# Altium schematic sheet ATmega328PB_Xplained_Mini_TopLevel.SchDoc: ATmega328PB Xplained Mini
size A3; Organization: ATMEL Norway; Address1: Vestre Rosten 79; Address2: N-7075 TILLER; Address3: NORWAY; DocumentNumber: A09-2523; Revision: 4; SheetNumber: 1; SheetTotal: 3; PageSetup: Record=PageOptions|CenterHorizontal=True|CenterVertical=True|PrintScale=1.01|XCorrection=1.00|YCorrection=1.00|PrintKind=1|BorderSize=5000000|LeftOffset=0|BottomOffset=0|Orientation=2|PaperLength=1000|PaperWidth=1000|Scale=100|PaperSource=7|PrintQuality=-4|MediaType=1|DitherType=10|PaperKind=Letter|PrintScaleMode=1
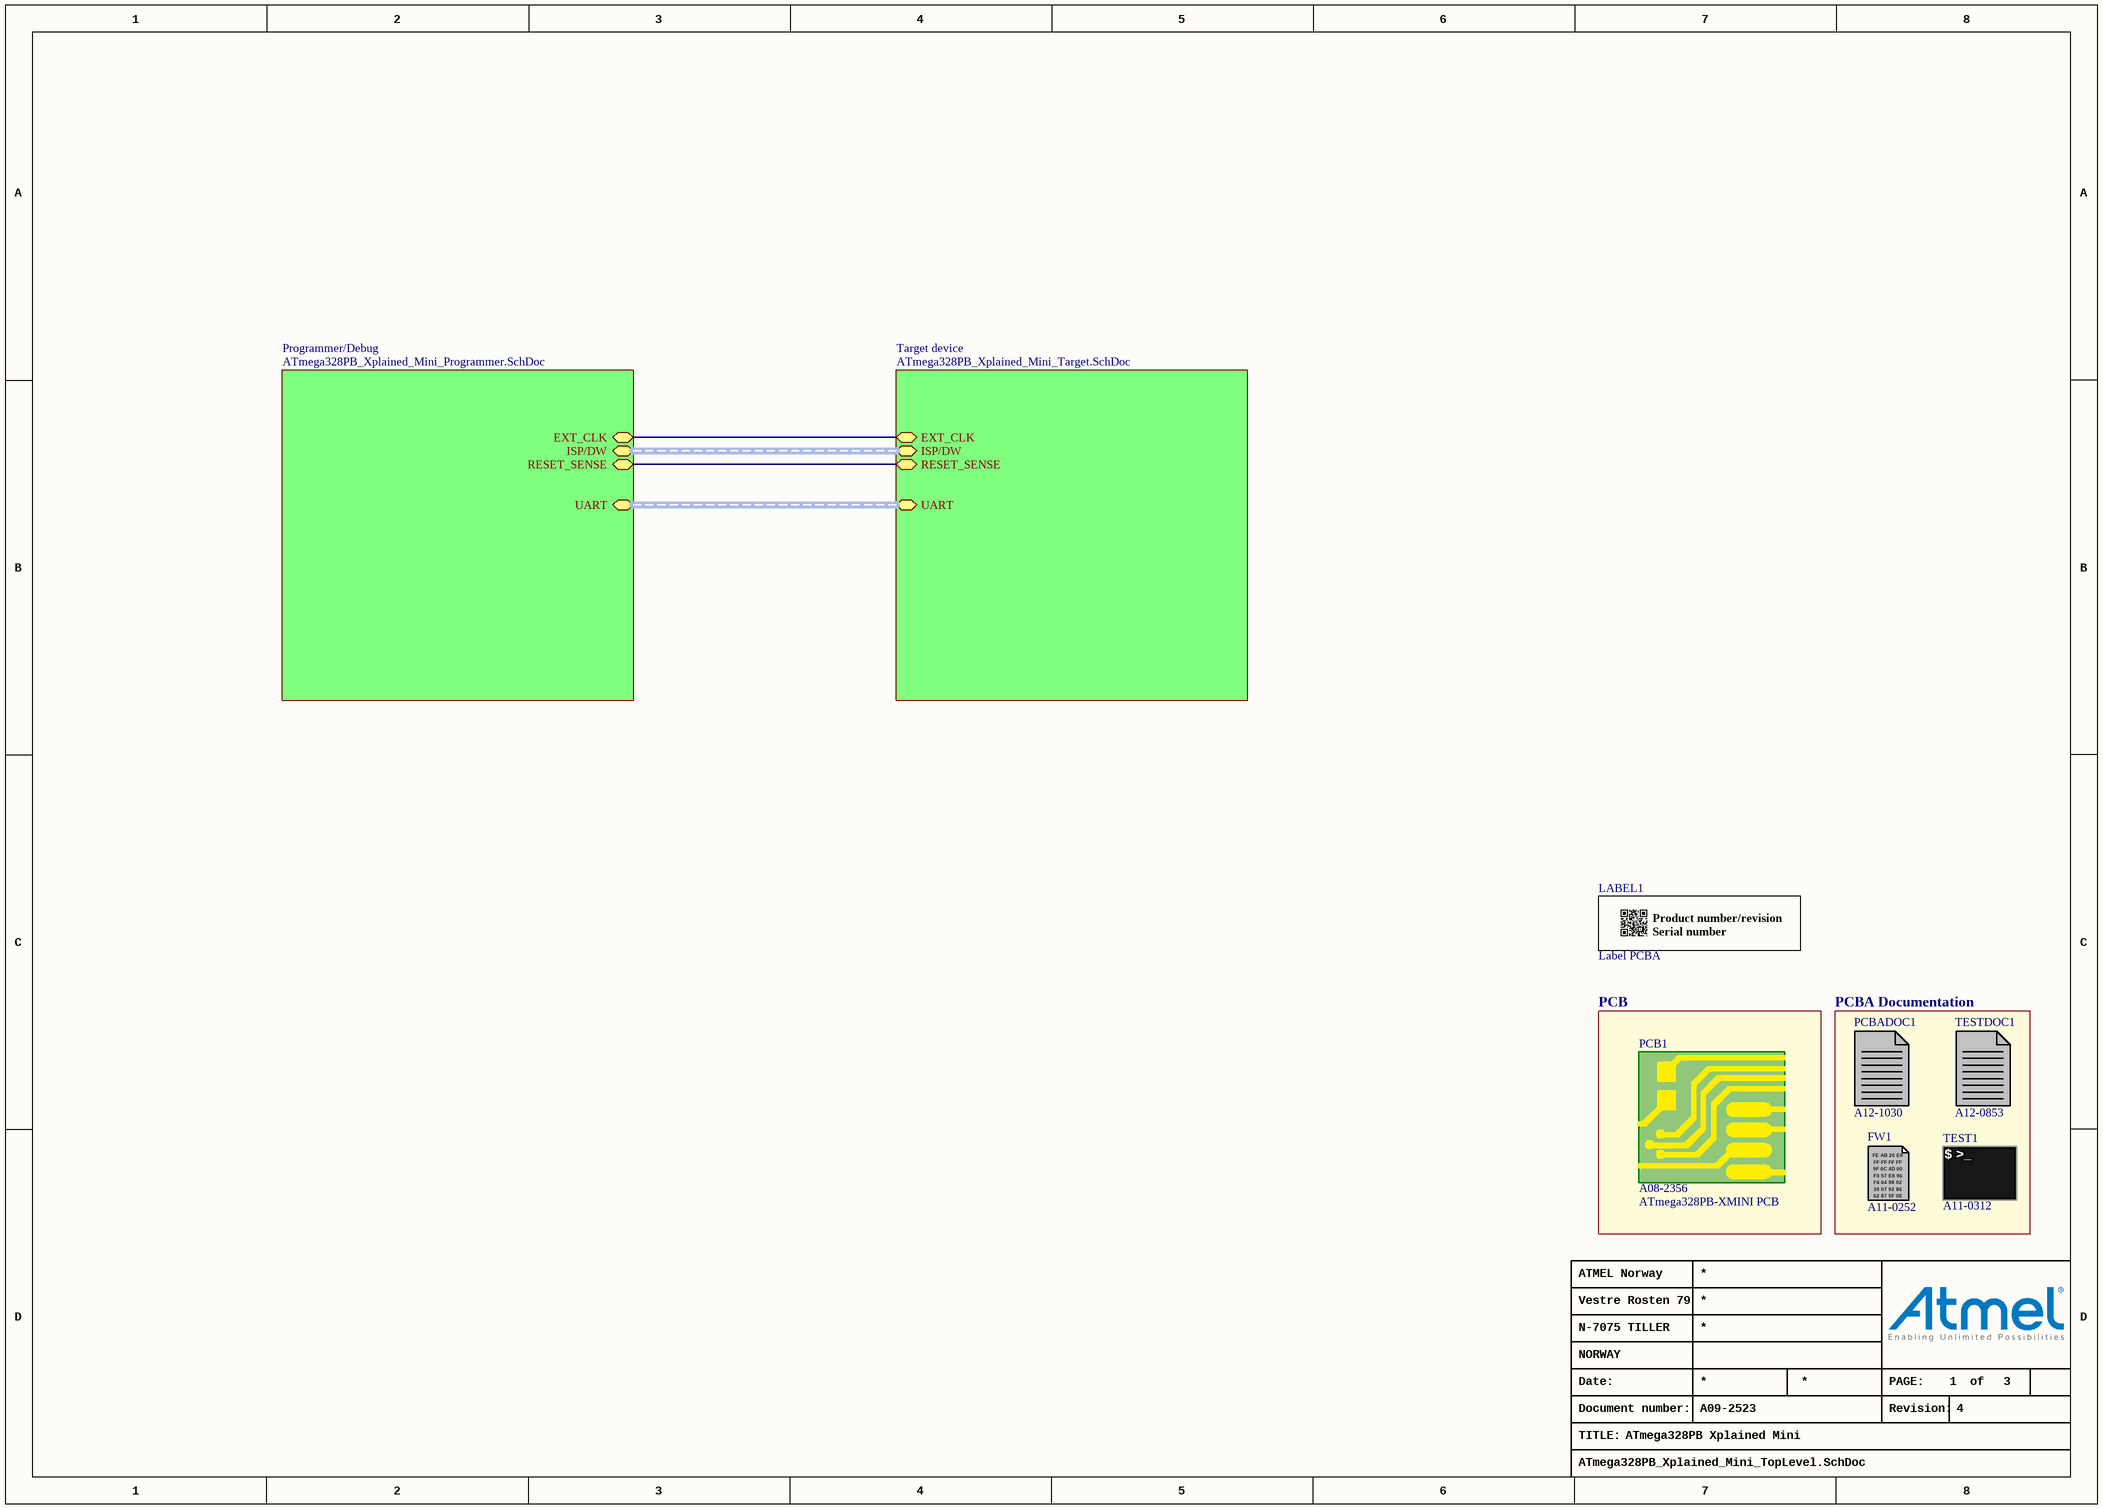
[diagram p0: ATmega328PB_Xplained_Mini_TopLevel.SchDoc]

## Parts
FW1  AN: A11-0252  (mechanical)
LABEL1  value Label PCBA  [AP8-00317]
PCB1  value ATmega328PB-XMINI PCB  AN: A08-2356  (mechanical)
PCBADOC1  AN: A12-1030  (mechanical)
TEST1  AN: A11-0312  (mechanical)
TESTDOC1  AN: A12-0853  (mechanical)

## Blocks framed on the sheet
PCB: PCB1
PCBA Documentation: FW1 PCBADOC1 TEST1 TESTDOC1

## Sub-sheets
Programmer/Debug = ATmega328PB_Xplained_Mini_Programmer.SchDoc: EXT_CLK (bidir), ISP/DW (harness ISP), UART (harness UART), RESET_SENSE
Target device = ATmega328PB_Xplained_Mini_Target.SchDoc: EXT_CLK (bidir), ISP/DW (harness ISP), UART (harness UART), RESET_SENSE

## Nets
(unnamed): sheet Programmer/Debug/EXT_CLK, sheet Target device/EXT_CLK
(unnamed): sheet Programmer/Debug/RESET_SENSE, sheet Target device/RESET_SENSE

## Buses and harness runs
harness sheet Programmer/Debug/ISP/DW = sheet Target device/ISP/DW
harness sheet Programmer/Debug/UART = sheet Target device/UART

## Notes on the sheet
- Date:
- PAGE:
- of
- TITLE:
- Document number:
- Revision:
- (in symbol A09-0611) / Product number/revision / Serial number
- (in symbol A11-0252) FE AB 26 E0; FF FF FF FF; 9F 0C 4D 00; F3 57 E8 96; F4 64 98 02; 35 07 92 86; 62 87 5F 0E
- (in symbol A11-0312) $ >_

## Library data of the parts
FW1 = A11-0252: MEDBG firmware; PartGroup: Software,Firmware,Tools; Value: MEDBG firmware
LABEL1 = A09-0611: PCBA identification label PP Top White Gloss; PartGroup: Mechanical devices,Packaging materials,Printed Labels; Manufacturer: ACT Logimark AS; MPN: 505462; AN: A09-0611
PCB1 = A08-2356: ATmega328PB-XMINI PCB documentation; PartGroup: Mechanical devices,Printed circuit boards
PCBADOC1 = A12-1030: mega328PB Xplained Mini PCBA documentation; PartGroup: Documentation,PCBA Documents,Atmel; Value: A09-2523 PCBA Files
TEST1 = A11-0312: Test SW for A09-2523 ,ATmega328PB Xplained Mini; PartGroup: Software,Test software,Tools; Value: Test SW for A09-2523
TESTDOC1 = A12-0853: Fixture Test Instructions forXplained Mini; PartGroup: Documentation,Procedures,Test Instructions; Value: Xplained Mini Test Instructions